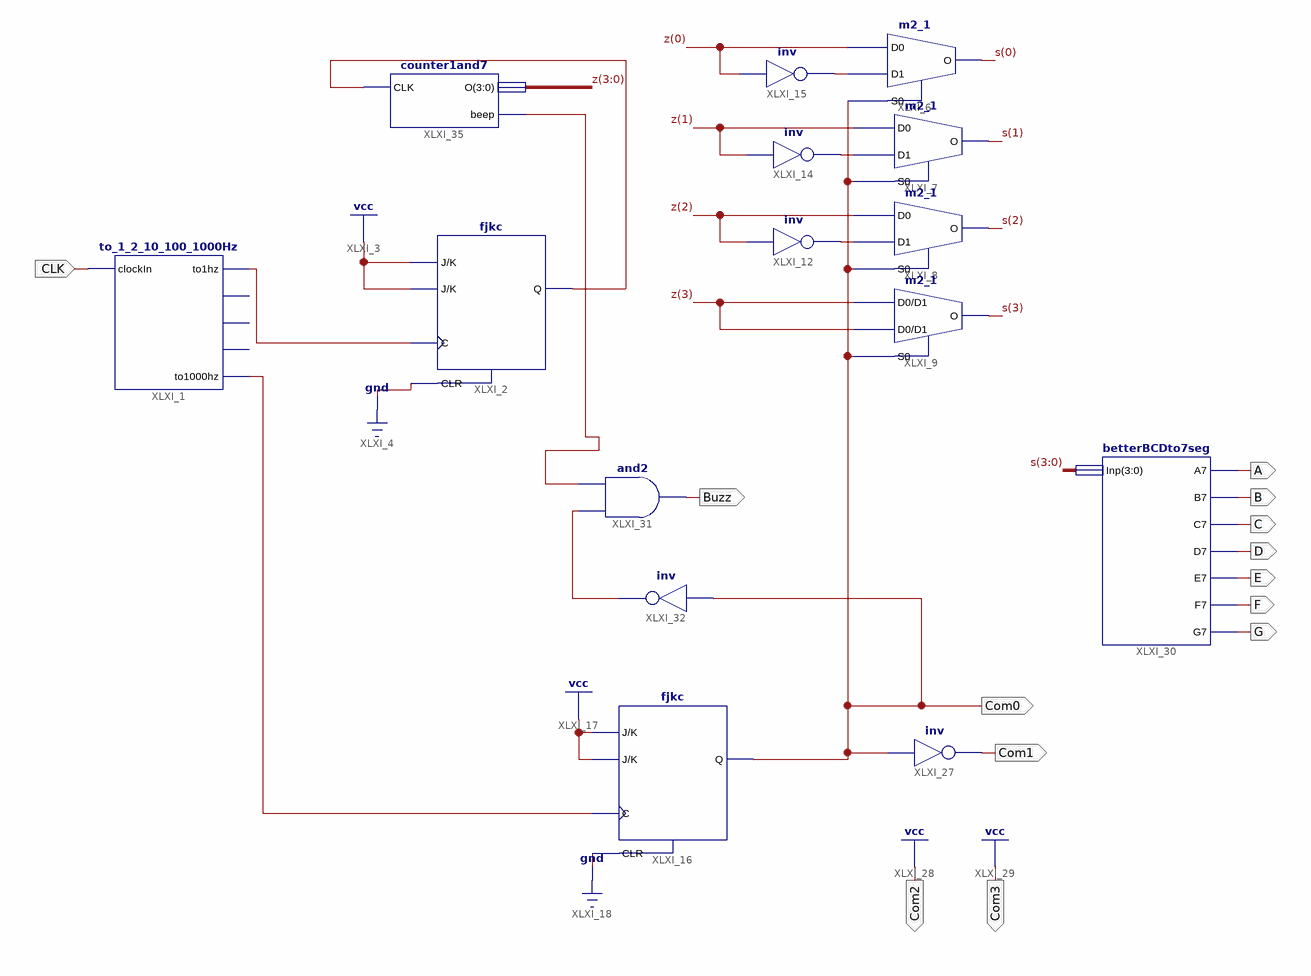
[diagram p0: schematic sheet 1]
// Xilinx ISE schematic main.sch (spartan6) as structural Verilog: 15 symbols, 13 ports
module main (
  input  CLK,
  output Com0,
  output Com1,
  output Com2,
  output Com3,
  output Buzz,
  output A,
  output B,
  output C,
  output D,
  output E,
  output F,
  output G
);

  wire XLXN_5, XLXN_11, XLXN_12, XLXN_13, XLXN_24, XLXN_52, XLXN_62, XLXN_63;
  wire [3:0] s, z;

  m2_1 XLXI_6 (.D0(z[0]), .D1(XLXN_13), .S0(Com0), .O(s[0]));
  m2_1 XLXI_7 (.D0(z[1]), .D1(XLXN_12), .S0(Com0), .O(s[1]));
  m2_1 XLXI_8 (.D0(z[2]), .D1(XLXN_11), .S0(Com0), .O(s[2]));
  m2_1 XLXI_9 (.D0(z[3]), .D1(z[3]), .S0(Com0), .O(s[3]));
  not XLXI_12 (XLXN_11, z[2]);
  not XLXI_14 (XLXN_12, z[1]);
  not XLXI_15 (XLXN_13, z[0]);
  fjkc XLXI_16 (.C(XLXN_24), .CLR(1'b0), .J(1'b1), .K(1'b1), .Q(Com0));
  to_1_2_10_100_1000Hz XLXI_1 (.clockIn(CLK), .to1hz(XLXN_5), .to1000hz(XLXN_24));  // open: to2hz, to10hz, to100hz
  fjkc XLXI_2 (.C(XLXN_5), .CLR(1'b0), .J(1'b1), .K(1'b1), .Q(XLXN_62));
  not XLXI_27 (Com1, Com0);
  betterBCDto7seg XLXI_30 (.Inp(s), .A7(A), .B7(B), .C7(C), .D7(D), .E7(E), .F7(F), .G7(G));
  not XLXI_32 (XLXN_52, Com0);
  and XLXI_31 (Buzz, XLXN_52, XLXN_63);
  counter1and7 XLXI_35 (.CLK(XLXN_62), .O(z), .beep(XLXN_63));

  assign Com2 = 1'b1;
  assign Com3 = 1'b1;
endmodule
